# EAGLE design Adafruit LIS3DH Original (EAGLE 6.4)
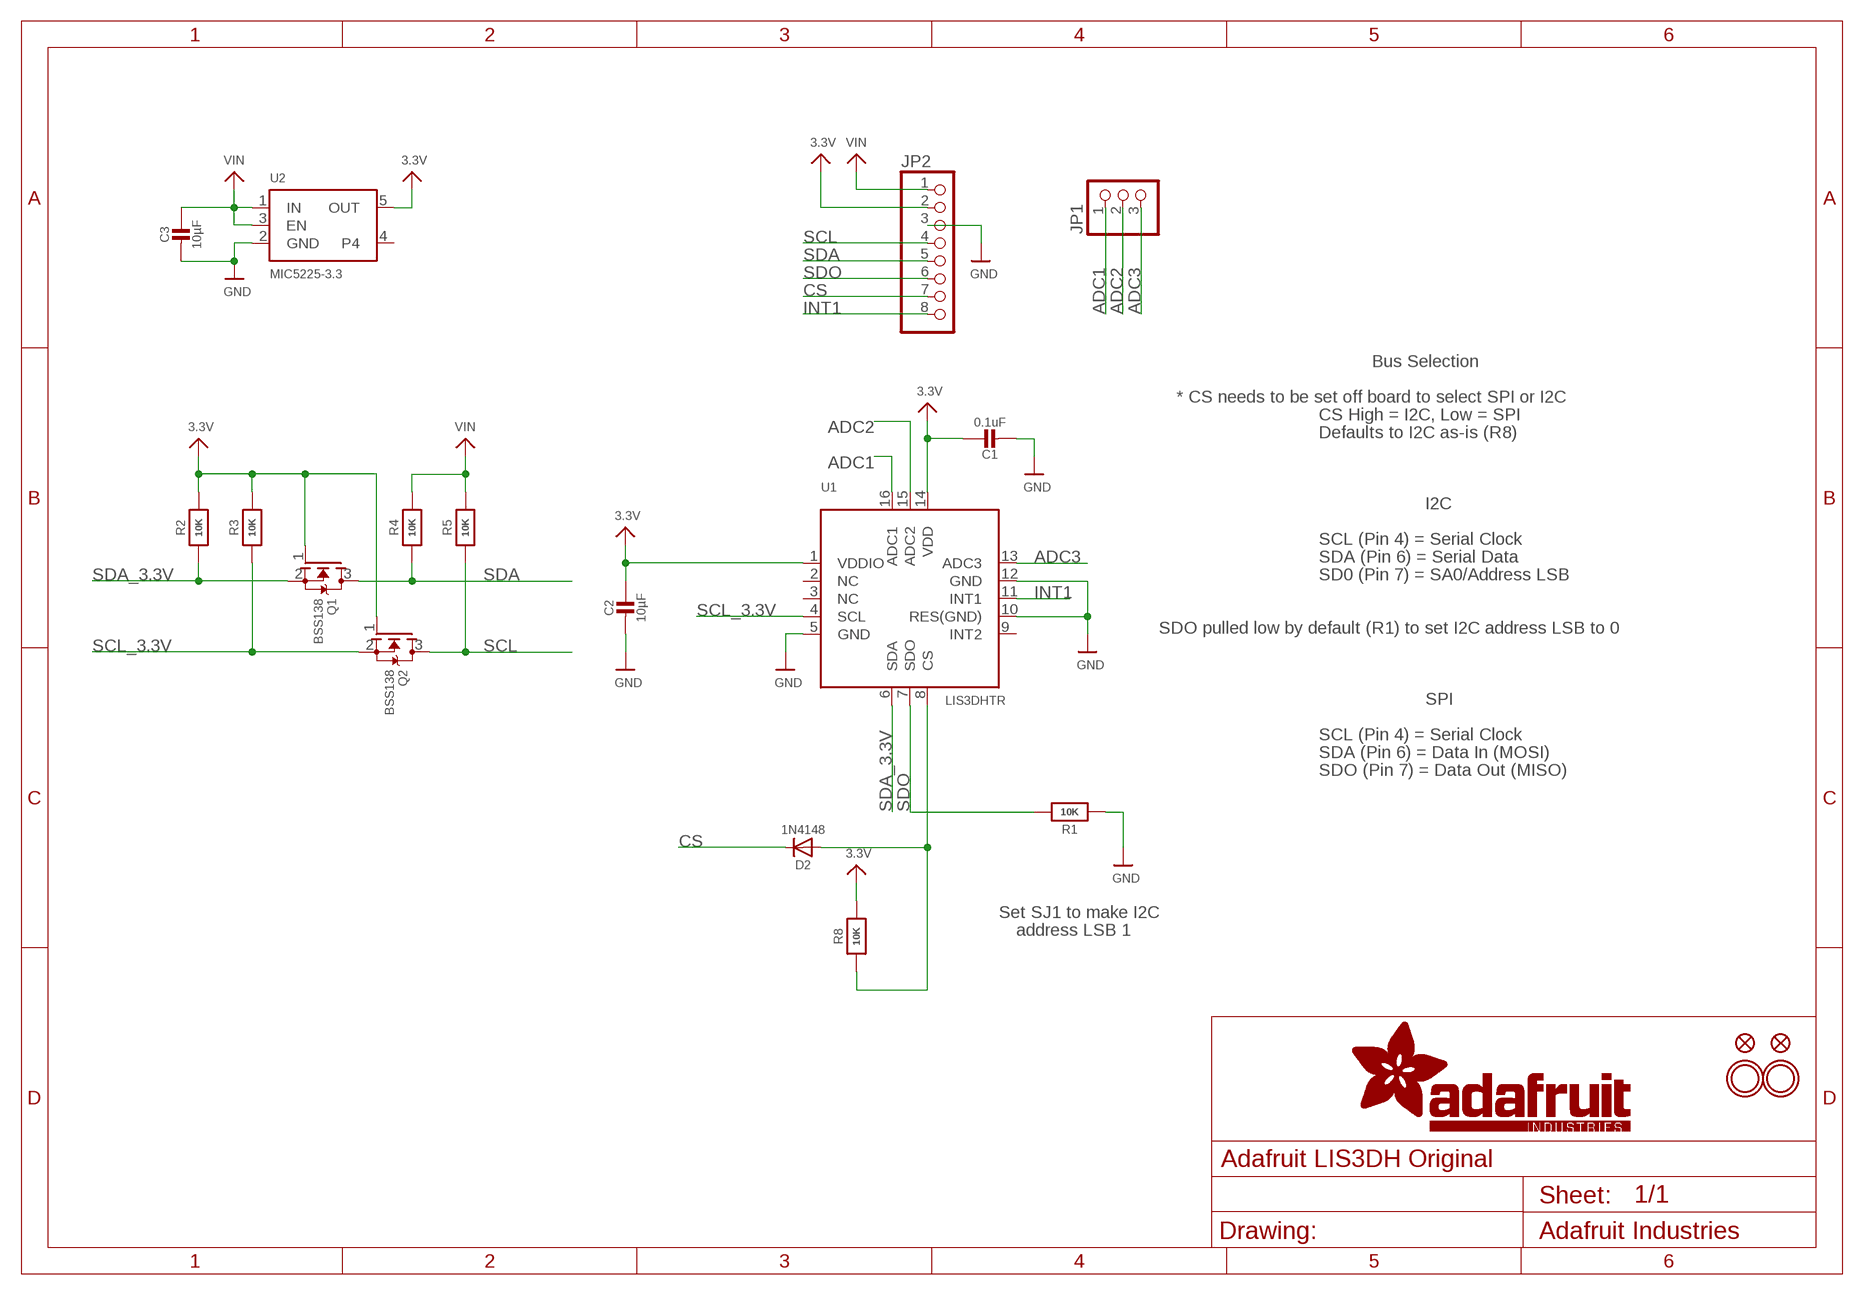
[diagram p0: schematic, sheet 1]

## Parts
C1  0.1uF  CAP_CERAMIC0805_10MGAP  [0805_10MGAP]
C2  10µF  CAP_CERAMIC0805-NOOUTLINE  [0805-NO]
C3  10µF  CAP_CERAMIC0805-NOOUTLINE  [0805-NO]
D2  1N4148  DIODESOD-323  [SOD-323]
FID1  FIDUCIAL""  [FIDUCIAL_1MM]
FID2  FIDUCIAL""  [FIDUCIAL_1MM]
JP1  HEADER-1X3ROUND  [1X03_ROUND]
JP2  HEADER-1X870MIL  [1X08_ROUND_70]
Q1  BSS138  MOSFET-NWIDE  [SOT23-WIDE]
Q2  BSS138  MOSFET-NWIDE  [SOT23-WIDE]
R1  10K  RESISTOR0805_NOOUTLINE  [0805-NO]
R2  10K  RESISTOR0805_NOOUTLINE  [0805-NO]
R3  10K  RESISTOR0805_NOOUTLINE  [0805-NO]
R4  10K  RESISTOR0805_NOOUTLINE  [0805-NO]
R5  10K  RESISTOR0805_NOOUTLINE  [0805-NO]
R8  10K  RESISTOR0805_NOOUTLINE  [0805-NO]
U1  LIS3DHTR  ACCEL_LIS3DHTR  [LGA16_3X3MM]
U2  MIC5225-3.3  VREG_SOT23-5  [SOT23-5]
U$10  MOUNTINGHOLE2.5  [MOUNTINGHOLE_2.5_PLATED]
U$13  MOUNTINGHOLE2.5  [MOUNTINGHOLE_2.5_PLATED]

## Nets
3.3V: C1.1 C2.1 JP2.2 Q1.1(G) Q2.1(G) R2.2 R3.2 R8.2 U1.1(VDDIO) U1.14(VDD) U2.5(OUT)
ADC1: JP1.1 U1.16(ADC1)
ADC2: JP1.2 U1.15(ADC2)
ADC3: JP1.3 U1.13(ADC3)
CS: D2.C JP2.7
GND: C1.2 C2.2 C3.2 JP2.3 R1.1 U1.5(GND) U1.10(RES(GND)) U1.12(GND) U2.2(GND)
INT1: JP2.8 U1.11(INT1)
N$2: D2.A R8.1 U1.8(CS)
SCL: JP2.4 Q2.3(D) R5.1
SCL_3.3V: Q2.2(S) R3.1 U1.4(SCL)
SDA: JP2.5 Q1.3(D) R4.1
SDA_3.3V: Q1.2(S) R2.1 U1.6(SDA)
SDO: JP2.6 R1.2 U1.7(SDO)
VIN: C3.1 JP2.1 R4.2 R5.2 U2.1(IN) U2.3(EN)
Unconnected: U1.2(NC) U1.3(NC) U1.9(INT2) U2.4

## Notes on the sheet
- Bus Selection
- * CS needs to be set off board to select SPI or I2C
- CS High = I2C, Low = SPI
- Defaults to I2C as-is (R8)
- I2C
- SCL (Pin 4) = Serial Clock
- SDA (Pin 6) = Serial Data
- SD0 (Pin 7) = SA0/Address LSB
- SDO pulled low by default (R1) to set I2C address LSB to 0
- SPI
- SCL (Pin 4) = Serial Clock
- SDA (Pin 6) = Data In (MOSI)
- SDO (Pin 7) = Data Out (MISO)
- Set SJ1 to make I2C
- address LSB 1

## Library data of the parts
C1-C3 = microbuilder:CAP_CERAMIC: Ceramic Capacitors For new designs, use the packages preceded by an '_' character since they are more reliable: The following footprints should be used on most boards: _0402 - Standard footprint for regular board layouts _0603 - Standard footprint for regular board layouts _0805 - Standard footprint for regular board layouts _1206 - Standard footprint for regular board layouts For extremely tight-pitch boards where space is at a premium, the following 'micro-pitch' footprints can be used (smaller pads, no silkscreen outline, etc.): _0402MP - Micro-pitch footprint for very dense/compact boards _0603MP - Micro-pitch footprint for very dense/compact boards _0805MP - Micro-pitch footprint for very dense/compact boards _1206MP - Micro-pitch footprint for very dense/compact boards
D2 = microbuilder:DIODE: Diode SMA Model Volts Amps Type Vf Ir Digikey # Notes SSA34-E3 40V 3A Schottky 480mV @ 3A 200uA @ 40V SSA34-E3/61TGITR-ND CDBA120-G 20V 1A Schottky 500mV @ 1A 500uA @ 20V 641-1014-6-ND REEL MBRA210 10V 2A Schottky 350mV @ 2A 700uA @ 10V MBRA210LT3 SOD-123 Model Volts Amps Type Vf Ir Order # Notes BAT54T1G 30V 200mA Schottky 800mV @ 200mA 2uA @ 25V BAT54T1GOSTR-ND B0530W 30V 500mA Schottky 430mV @ 500mA 130uA @ 30V B0530W-FDICT-ND REEL MBR120 20V 1A Schottky 340mV @ 1A MBR120VLSFT1GOSCT-ND SOD-323 Model Volts Amps Type Vf Ir Order # Notes PMEG2005EJ 20V 500mA Schottky 355mV @ 500mA 568-4110-1-ND ZLLS410 10V 570mA Schottky 380mV @ 570mA ZLLS410CT-ND 1N4148WS 75V 150mA Silicon/Simple 1V 1N4148WSFSCT-ND REEL SOD-523 Model Volts Amps Type Vf Ir Order # Notes BAT54XV2 30V 200mA Schottky 0.8V @ 100mA BAT54XV2CT-ND TB751S 30V 30mA Schottky RB751S-40TE61CT-ND SOT23-R/W (R = Solder Paste/Reflow Ovens, W = Hand-Soldering) Model Volts Amps Type Vf Ir Order # Notes BAT54FILM 40V 300mA Schottky 497-7162-1-ND POWERDI-5 Model Volts Amps Type Vf Ir Order # Notes PDS560 60V 5A Schottky 670mV @ 5A 150uA @ 60V PDS560DICT-ND
FID1 FID2 = microbuilder:FIDUCIAL: Fiducial Alignment Points Various fiducial points for machine vision alignment.; BOM: EXCLUDE
JP1 = microbuilder:HEADER-1X3: PIN HEADER
JP2 = microbuilder:HEADER-1X8: PIN HEADER
Q1 Q2 = microbuilder:MOSFET-N: N-Channel Mosfet LEGEND VDS: Voltage Drain-Source ID: Drain Current RDS(ON): Drain-Source On-State Resistance VGS(TH): Gate-Source Threshold Voltage CISS: Drain-Source Input Capacitance SOT-23 Name VDS ID RDS(ON) VGS(TH) CISS Order Number 2N7002E 60V 260mA 2.5 Ohm 2.5V @ 250uA 26.7pF @ 25V 2N7002ET1GOSTR-ND BSH103 30V 850mA 400 mOhm 400mV @ 1mA 83pF @ 24V BSH103,235-ND BSS138 60V 320mA 1.6 Ohm 1.5V @ 250uA 50pF @ 10V Mouser: 771-BSS138PW115 DMN2075U-7 20V 4.2A 38 mOhm 1V @ 250 uA 594.3pF @ 10V DMN2075U-7DICT-ND * BSS138 good choice for I2C level-shifting POWERPAK 1212-8 Name VDS ID RDS(ON) VGS(TH) CISS Order Number Si7308DN 60V 6A 58 mOhm 3V @ 250uA 665pF @ 15V SI7308DN-T1-E3CT-ND
R1-R5 R8 = microbuilder:RESISTOR: Resistors For new designs, use the packages preceded by an '_' character since they are more reliable: The following footprints should be used on most boards: _0402 - Standard footprint for regular board layouts _0603 - Standard footprint for regular board layouts _0805 - Standard footprint for regular board layouts _1206 - Standard footprint for regular board layouts For extremely tight-pitch boards where space is at a premium, the following 'micro-pitch' footprints can be used (smaller pads, no silkscreen outline, etc.): _0402MP - Micro-pitch footprint for very dense/compact boards _0603MP - Micro-pitch footprint for very dense/compact boards _0805MP - Micro-pitch footprint for very dense/compact boards _1206MP - Micro-pitch footprint for very dense/compact boards
U1 = microbuilder:ACCEL_LIS3DHTR: LIS3DHTR 3-Axis Accelerometer with I2C/SPI Interface VDD: 1.71-3.6V VDDIO: 1.71-VDD+0.1V Scale: +/-2g, 4g, 8g, 16g with 16--bit data output Temp:: -40°C - 85°C Mouser: 511-LIS3DHTR Digikey: 497-10613-1-ND
U2 = microbuilder:VREG_SOT23-5: SOT23-5 Fixed Voltage Regulators Part Current Out V Out V In V Dropout θJA (°C/W) TJ (°C) Digikey Part No. ADP121 150mA 3.3V 3.4-5.5V 0.09V @ 150mA -- -- ADP121-AUJZ33R7CT-ND ADP121 150mA 3.0V 3.1-5.5V 0.09V @ 150mA -- -- ADP121-AUJZ30R7CT-ND ADP122 300mA 3.3V 3.4-5.5V 0.085V @ 300mA -- -- ADP122AUJZ-3.3-R7CT-ND ADP1712 300mA 3.3V 3.5-5.5V 0.17V @ 300mA -- -- ADP1712AUJZ-3.3-R7TR-ND AP7311 (Low Cost) 150mA 3.3V 3.5-6V 0.15V @ 150mA -- -- AP7311-33WG-7DICT-ND LD39015M18R 150mA 1.8V 1.9V-5.5V 0.08V @ 100mA -- -- 497-6977-1-ND LP2985A-33DBVR 150mA 3.3V 3.3-16V 0.28V @ 150mA 206 150 296-18479-1-ND MCP1824T-3302E/OT 300mA 3.3V 3.5V-6V 0.2V @ 300mA -- -- MCP1824T-3302E/OTCT-ND MIC5205-2.5YM5 TR 150mA 2.5V 2.7-16V 0.165V @ 150mA -- -- 576-1257-2-ND MIC5205-3.0YM5 TR 150mA 3.0V 3.2V-16V 0.165V @ 150mA -- -- 576-1258-2-ND MIC5205-3.3YM5 TR 150mA 3.3V 3.5V-16V 0.165V @ 150mA -- -- 576-1259-2-ND TPS780330220 150mA 3.3V+2.2V 3.6-5.5V 250mV Max -- -- 296-23332-1-ND TDA3663/N1,135 100mA 3.3V 3.5-45V 0.18V @ 50mA -- -- 568-5343-1-ND Max operating temp can be calculated using θJA, TJ (max junction temperature), and power in watts. Set the "Maximum Ambient Temperature" until it reaches TJ ("Max Junction Temperature"), which is the absolute limit for safe use of the regulator: Heat Sink Temperature Calculator <http://www.daycounter.com/Calculators/Heat-Sink-Temperature-Calculator.phtml> For example, With 12V source into a 3.3V LP2985 and a 30mA load, we are dissipating (12V-3.3V) * 0.03A = 0.261W. With a θJA of 206 °C/W, a TJ of 150°C, and 261mW we can safely use the chip without a heat sink up to 75°C (=147.1°C Junction Temperature).
U$10 U$13 = microbuilder:MOUNTINGHOLE: Mounting Hole For #2 screws (0.086"/2.18mm width, 0.094"/2.4mm hole) use 2.5mm; BOM: EXCLUDE

## Board
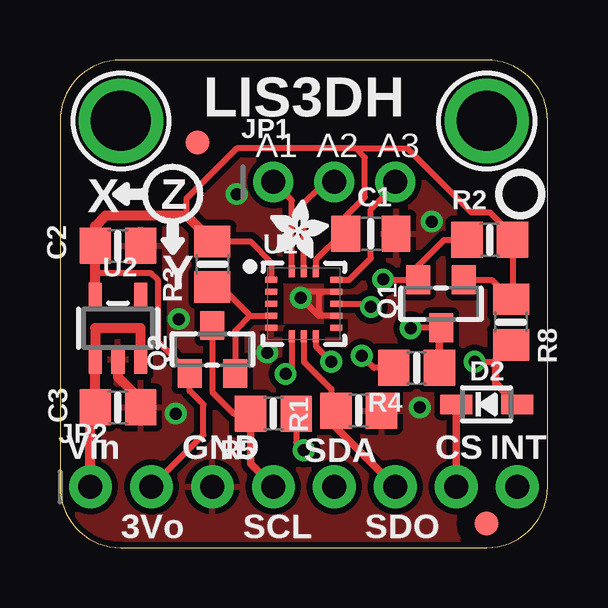
[diagram p1: board, top side]
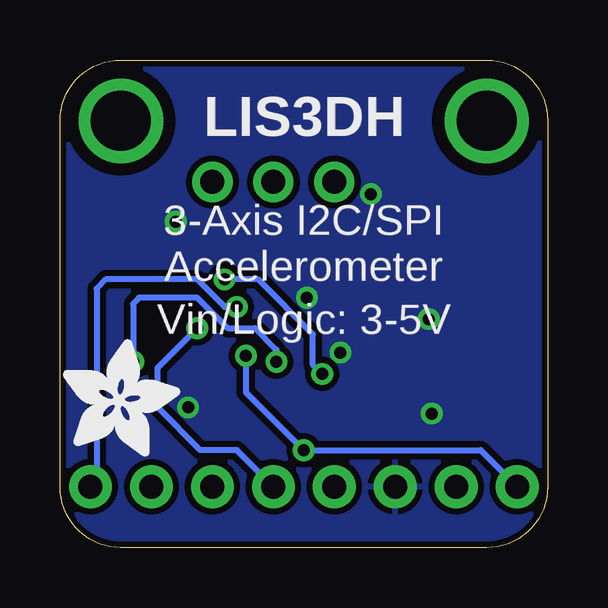
[diagram p2: board, bottom side, seen from below]

Size 20.32 x 20.32 mm. Coordinates in mm from the lower left corner, seen from the top.
Outline: 0,17.78 0,2.54 arc90 2.54,0 17.78,0 arc90 20.32,2.54 20.32,17.78 arc90 17.78,20.32 2.54,20.32 arc90 0,17.78
Copper layers (1*16): Top 0.035mm / dielectric 1.5mm / Bottom 0.035mm
Design rules "adafruit *": minimum track width 8mil, minimum drill 15.5mil, track to track 8mil, track to pad 8mil, pad to pad 8mil, via to via 8mil, smd to smd 8mil, copper to edge 10mil, drill to drill 8mil, minimum pad ring 10mil, minimum via ring 8mil, stop-mask expansion 2mil, vias tented up to drill 20mil, thermal gap 10mil

### Footprints (pad centres in the part's own frame; a part is rotated, then mirrored left to right if it is on the bottom)
0805_10MGAP = smd 1.2 x 1.5: 1 -1.05,0; 2 1.05,0
0805-NO = smd 1.3 x 1.5: 1 -0.95,0; 2 0.95,0
SOD-323 = smd 1.35 x 0.8: A 1.27,0; C -1.27,0
FIDUCIAL_1MM = smd 1 x 1: 1 0,0
1X03_ROUND = drill 1 pad 1.676: 1 -2.54,0; 2 0,0; 3 2.54,0
1X08_ROUND_70 = drill 1 pad 1.778: 1 -8.89,0; 2 -6.35,0; 3 -3.81,0; 4 -1.27,0; 5 1.27,0; 6 3.81,0; 7 6.35,0; 8 8.89,0
SOT23-WIDE = smd 1 x 1.2: 1 -0.95,-1; 2 0.95,-1; 3 0,1
LGA16_3X3MM = smd 0.5 x 0.25: 1 -1.35,1; 2 -1.35,0.5; 3 -1.35,0; 4 -1.35,-0.5; 5 -1.35,-1; 9 1.35,-1; 10 1.35,-0.5; 11 1.35,0; 12 1.35,0.5; 13 1.35,1 | smd 0.25 x 0.5: 6 -0.5,-1.35; 7 0,-1.35; 8 0.5,-1.35; 14 0.5,1.35; 15 0,1.35; 16 -0.5,1.35
SOT23-5 = smd 0.55 x 1.2: 1 -0.95,-1.3; 2 0,-1.3; 3 0.95,-1.3; 4 0.95,1.3; 5 -0.95,1.3
MOUNTINGHOLE_2.5_PLATED = drill 2.5 pad 3.2: P$1 0,0

### Placement (x,y rotation side)
C1  12.95,13.08 0 top
C2  2.41,12.57 0 top
C3  2.41,5.84 0 top
D2  17.78,5.97 0 top
FID1  5.73,16.88 0 top
FID2  17.78,1.02 0 top
JP1  11.43,15.24 0 top
JP2  10.16,2.54 0 top
Q1  15.88,10.16 180 top
Q2  6.35,8.26 0 top
R1  12.45,5.71 180 top
R2  17.91,12.83 0 top
R3  6.35,11.81 90 top
R4  14.86,7.49 180 top
R5  8.89,5.59 0 top
R8  18.8,9.4 90 top
U1  10.16,10.16 0 top
U2  2.41,9.14 0 top
U$9  [PCBFEAT-REV-040]  19.18,14.73 0 top
U$10  2.54,17.78 0 top
U$13  17.78,17.78 0 top
U$21  [ADAFRUIT_2.5MM]  8.76,12.06 0 top
U$22  [ADAFRUIT_5MM]  20.19,3.81 0 bottom

### Tracks (layer width: path | path; a pad name or v marks a point on that pad's centre or on a via)
3.3V
  Top 0.254: R3.2 7.94,12.76 8.81,11.89 U1.1 | JP2.2 5.97,4.7 5.97,5.97 5.4,6.54 Q2.1 4.06,8.59 4.06,11.18 3.81,11.43 1.46,11.43 | Q1.1 17.98,11.16 R8.2 18.86,10.41 R2.2 18.8,12.89 18.8,13.08 17.91,13.97 17.14,13.97 14.48,16.64 12.32,16.64 | 12.32,16.64 12.7,16.26 12.7,14.61 11.9,13.81 C1.1 11.75,13.08 10.66,11.99 U1.14 | 12.32,16.64 7.37,16.64 5.27,14.54 5.27,13.84
  Top 0.406: U2.5 1.46,11.43 C2.1 1.46,13.4 1.91,13.84 5.27,13.84 R3.2
ADC1
  Top 0.254: U1.16 9.66,14.47 JP1.1
ADC2
  Top 0.254: U1.15 10.16,14.35 10.79,14.99 11.18,14.99 JP1.2
ADC3
  Top 0.254: U1.13 12.05,11.16 12.95,12.06 12.95,14.1 13.97,15.11 JP1.3
CS
  Top 0.305: D2.C JP2.7
GND  (via drill 0.5)
  Top 0.254: 10.91,9.66 10.79,9.78 10.79,10.54 10.92,10.67 | U1.12 10.28,10.66 v10.03,10.41 10.79,9.66 U1.10
  Top 0.406: U2.2 2.41,7.11 3.36,6.16 C3.2
  other vias: 4.95,9.53 8.64,8.13 14.99,5.84 4.83,5.59 15.49,13.59 7.37,14.73
  pour Bottom (isolate 0.254): -0.13,-0.13 0,20.3 20.55,20.3 20.55,-0.13
  pour Top (isolate 0.254): -0.25,-0.13 -0.13,20.3 20.43,20.3 20.43,-0.13
INT1  (via drill 0.5)
  Top 0.254: U1.11 12.83,10.16 v12.95,10.03
  Bottom 0.254: v12.95,10.03 13.46,10.03 14.61,11.18 18.41,11.18 18.8,10.79 18.8,2.79 JP2.8
N$2  (via drill 0.5)
  Top 0.254: U1.8 10.66,8.39 v11.3,7.75 | v17.27,7.75 18.16,7.75
  Top 0.305: D2.A 18.16,6.86 18.16,7.75 18.16,7.81 R8.1
  Bottom 0.254: v17.27,7.75 17.27,10.16 17.02,10.41 14.61,10.41 13.34,9.14 12.19,9.14 11.3,8.26 v11.3,7.75
SCL
  Top 0.254: Q2.3 6.35,6.48 7.24,5.59 R5.1
  Top 0.305: 7.81,5.59 R5.1 7.94,3.49 JP2.4
SCL_3.3V
  Top 0.254: 7.93,9.66 U1.4 | 7.93,9.66 7.3,9.03 Q2.2 | 7.93,9.66 6.73,10.86 R3.1
SDA  (via drill 0.5)
  Top 0.254: v14.61,9.14 14.62,9.16 Q1.3 15.81,9.09 15.81,8.85
  Top 0.305: 15.81,8.85 R4.1
  Bottom 0.254: JP2.5 12.95,4.06 14.48,4.06 16.26,5.84 16.26,7.49 v14.61,9.14
SDA_3.3V  (via drill 0.5)
  Top 0.254: U1.6 9.66,7.5 v9.4,7.24 | R2.1 16,12.83 14.93,11.75 Q1.2 13.48,11.16 v13.46,11.18
  Bottom 0.254: v9.4,7.24 9.78,7.62 9.78,8.89 12.06,11.18 v13.46,11.18
SDO
  Top 0.254: U1.7 10.16,7.75 11.3,6.6 11.3,5.91
  Top 0.305: 11.3,5.91 R1.2 11.5,5.01 JP2.6
VIN  (via drill 0.5)
  Top 0.254: R5.2 9.84,4.38 v10.16,4.06 | R4.2 13.08,7.49 v12.57,8
  Top 0.406: JP2.1 1.27,5.65 C3.1 U2.1 1.46,9.14 3.36,9.14 U2.3
  Bottom 0.254: JP2.1 2.79,4.06 v10.16,4.06 12.57,6.48 v12.57,8

### Text on the board
tPlace: LIS3DH | A1 | A2 | A3 | X | Z | Y | Vin | GND | SDA | CS | INT | 3Vo | SCL | SDO
bPlace: LIS3DH | 3-Axis I2C/SPI / Accelerometer | Vin/Logic: 3-5V